# EAGLE design LoRasPI (EAGLE 7.6.0)
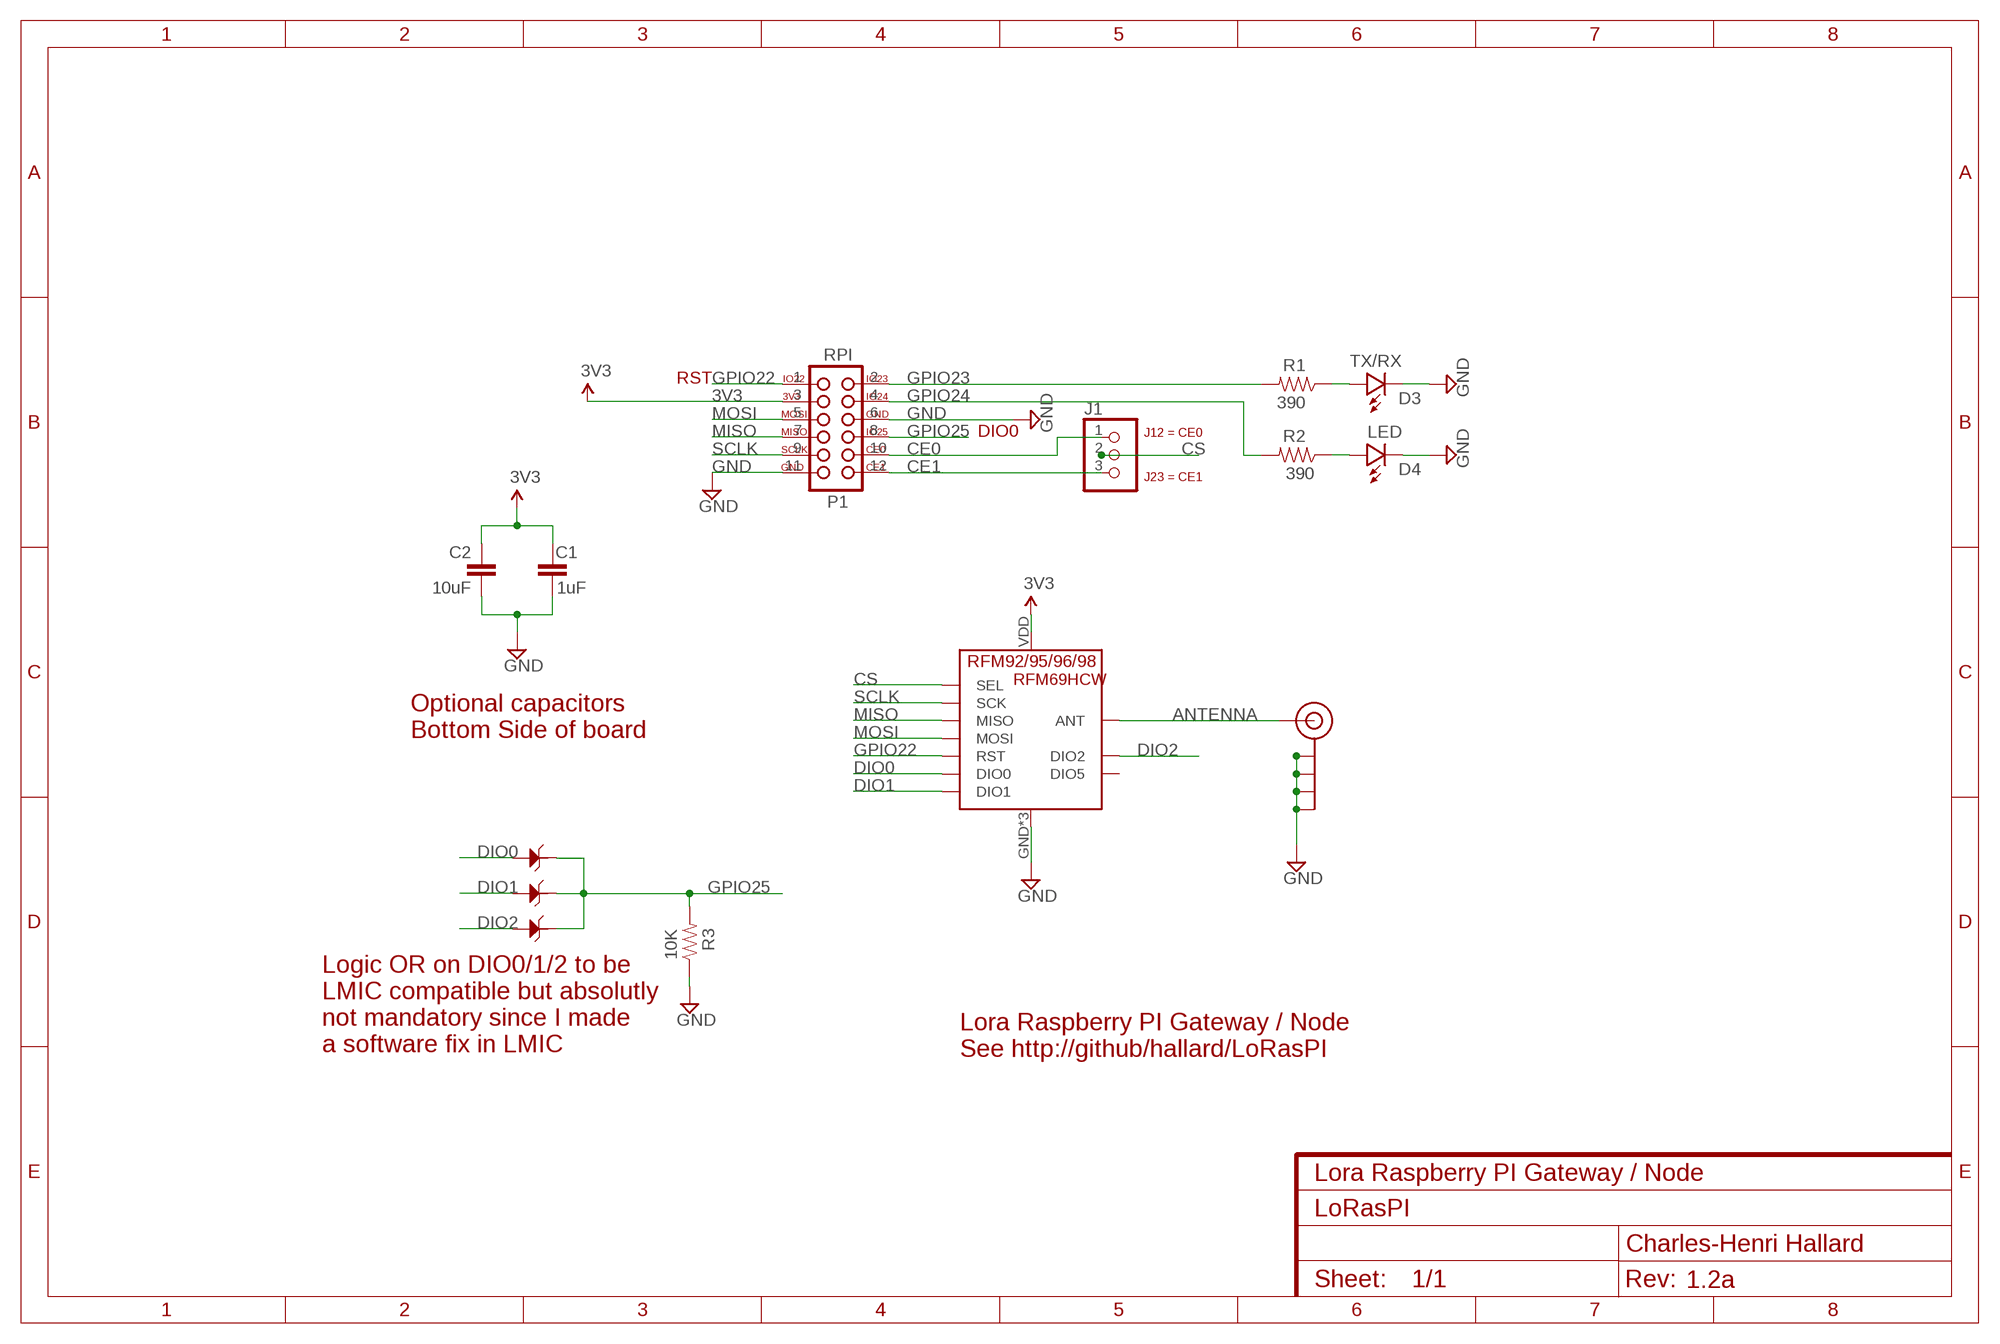
[diagram p0: schematic, sheet 1]
NAME (FRAME-A4L): CNAME: Lora Raspberry PI Gateway / Node; CREVISION: 1.2a; DESIGNER: Charles-Henri Hallard

## Parts
C1  1uF  CAP0805-CAP-LARGEPADS  [0805-CAP-LARGEPADS]
C2  10uF  CAP0805-CAP-LARGEPADS  [0805-CAP-LARGEPADS]
D0  1N4148  D-ESD-2P-CESD5V0D1  [SOD123-2.7X1.6]
D1  1N4148  D-ESD-2P-CESD5V0D1  [SOD123-2.7X1.6]
D2  1N4148  D-ESD-2P-CESD5V0D1  [SOD123-2.7X1.6]
D3  TX/RX  LED0805-LARGE  [0805-LED-LARGEPADS]
D4  LED  LED0805-LARGE  [0805-LED-LARGEPADS]
HOPE-RF  RFM92/95/96/98  RFM95  [RFM95]
J1  JUMPER_1X30805  [JP3_0805]
J$1  ANTENNATINY  [SMA_UFL_PAD_TINY]
R1  390  RESISTOR0805-RES  [0805-RES]
R2  390  RESISTOR0805-RES  [0805-RES]
R3  10K  RESISTOR0805-RES  [0805-RES]
U$2  RASPBERRY_PI_2X6_BOTTOM  [2X06_LOCK]

## Nets
3V3: C1.2 C2.2 HOPE-RF.VDD(VCC) U$2.3
ANTENNA: HOPE-RF.ANT J$1.ANT1(SIGNAL) J$1.ANT2(SIGNAL) J$1.ANT3(SIGNAL)
CE0: J1.1 U$2.10
CE1: J1.3 U$2.12
CS: HOPE-RF.NSS(SEL) J1.2
DIO0: D0.1 HOPE-RF.DIO0
DIO1: D1.1 HOPE-RF.DIO1
DIO2: D2.1 HOPE-RF.DIO2
GND: C1.1 C2.1 D3.MINUS D4.MINUS HOPE-RF.GND HOPE-RF.GND1(GND) HOPE-RF.GND2(GND) J$1.GND1(GND) J$1.GND2(GND) J$1.GND3(GND) J$1.GND4(GND) R3.1 U$2.6 U$2.11
GPIO22: HOPE-RF.RST U$2.1
GPIO23: R1.2 U$2.2
GPIO24: R2.2 U$2.4
GPIO25: D0.2 D1.2 D2.2 R3.2 U$2.8
MISO: HOPE-RF.MISO U$2.7
MOSI: HOPE-RF.MOSI U$2.5
N$1: D3.PLUS R1.1
N$2: D4.PLUS R2.1
SCLK: HOPE-RF.SCK U$2.9
Unconnected: HOPE-RF.DIO5

## Notes on the sheet
- RST
- DIO0
- CS
- CS | RFM69HCW
- Optional capacitors
  Bottom Side of board
- Lora Raspberry PI Gateway / Node
- Logic OR on DIO0/1/2 to be
  LMIC compatible but absolutly
  not mandatory since I made
  a software fix in LMIC
- See http://github/hallard/LoRasPI

## Library data of the parts
C1 C2 = _c2h:CAP: Capacitor Standard 0603 ceramic capacitor, and 0.1" leaded capacitor.
D0 D1 D2 = Seeed-Discrete:D-ESD-2P: Diodes for Protectiong against ESD
D3 D4 = _c2h:LED
HOPE-RF = _c2h:RFM95
J1 = dp_devices:JUMPER_1X3; J12: CE0; J23: CE1
J$1 = _c2h:ANTENNA: SMA Antenna Connector End launch SMA connector. The paste layer has been removed so that the connector can be hand soldered onto the board after reflow.
R1-R3 = _c2h:RESISTOR: Resistor Basic schematic elements and footprints for 0603, 1206, and PTH resistors.
U$2 = _c2h:RASPBERRY_PI_2X6_BOTTOM

## Board
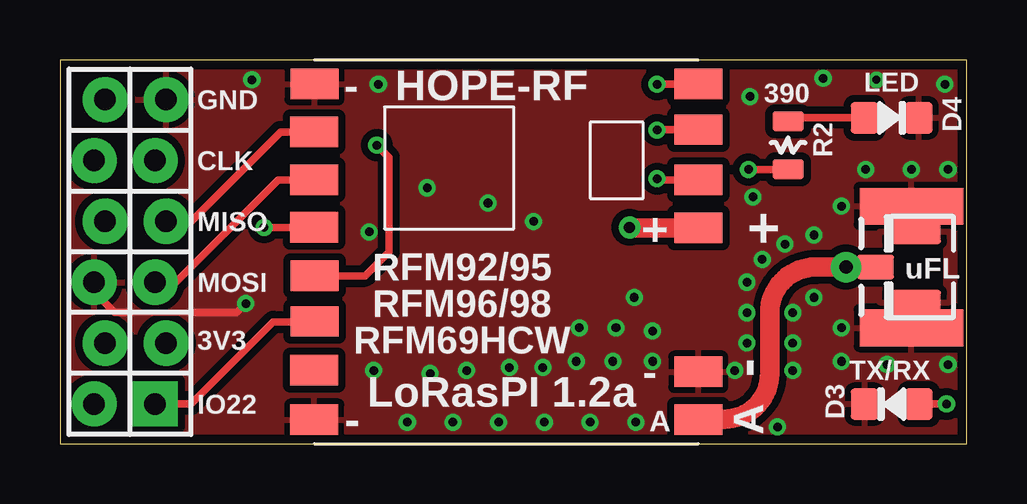
[diagram p1: board, top side]
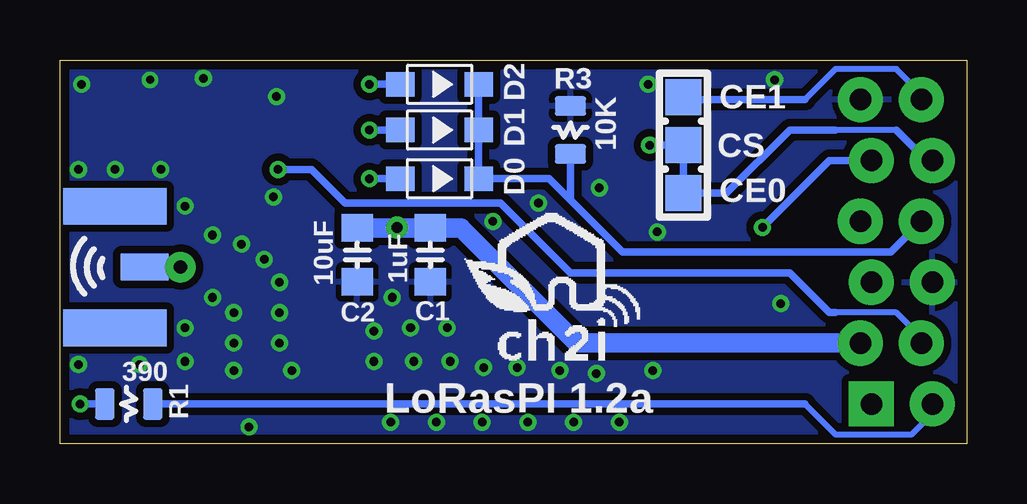
[diagram p2: board, bottom side, seen from below]

Size 37.79 x 16 mm. Coordinates in mm from the lower left corner, seen from the top.
Outline: 0,0 37.79,0 37.79,16 0,16 0,0
Copper layers (1*16): Top 0.0356mm / dielectric 1.5011mm / Bottom 0.0356mm
Design rules "PCBs_io": minimum track width 6mil, minimum drill 13mil, track to track 6mil, track to pad 6mil, pad to pad 6mil, via to via 6mil, smd to smd 6mil, copper to edge 15mil, drill to drill 6mil, minimum pad ring 7mil, minimum via ring 7mil, stop-mask expansion 3mil, vias tented up to drill 40mil, thermal gap 10mil

### Footprints (pad centres in the part's own frame; a part is rotated, then mirrored left to right if it is on the bottom)
0805-CAP-LARGEPADS = smd 1.156 x 1.3: 1 -1.127,0; 2 1.127,0
SOD123-2.7X1.6 = smd 1.2 x 1.02: 1 -1.635,0; 2 1.635,0
0805-LED-LARGEPADS = smd 1.156 x 1.3: MINUS -1.127,0; PLUS 1.127,0
RFM95 = smd 2 x 1.27: ANT 5.777,-7; DIO0 5.777,3; DIO1 5.779,5.095; DIO2 5.779,7; DIO5 -10.225,-4.936; GND 5.777,-5; GND1 -10.223,7; GND2 -10.23,-7; MISO -10.23,5; MOSI -10.225,3; NSS -10.223,-1; RST -10.223,-2.905; SCK -10.23,1.012; VDD 5.777,1
JP3_0805 = smd 1.5 x 1.5: 1 -2,0; 2 0,0; 3 2,0
SMA_UFL_PAD_TINY = smd 1.524 x 1.016: ANT1 -3.843,0 | drill 0.559 pad 1.27: ANT2 -5.08,0 | smd 2.032 x 1.143 bottom: ANT3 -3.589,0 | smd 2.2 x 1.016: GND1 -2.223,1.47; GND2 -2.223,-1.47 | smd 4.318 x 1.524: GND3 -2.349,-2.54; GND4 -2.349,2.54 | smd 4.318 x 1.524 bottom: GND5 -2.349,2.54; GND6 -2.349,-2.54
0805-RES = smd 0.8 x 1.3: 1 -1,0; 2 1,0
2X06_LOCK = drill 0.9 pad 1.88 square: 1 -6.35,-1.041 | drill 0.9 pad 1.88: 2 -6.35,1.499; 3 -3.81,-1.499; 4 -3.81,1.041; 5 -1.27,-1.041; 6 -1.27,1.499; 7 1.27,-1.499; 8 1.27,1.041; 9 3.81,-1.041; 10 3.81,1.499; 11 6.35,-1.499; 12 6.35,1.041

### Placement (x,y rotation side)
C1  22.35,7.87 90 bottom
C2  25.4,7.87 90 bottom
D0  21.97,11.05 0 bottom
D1  21.97,13.08 0 bottom
D2  21.97,14.99 0 bottom
D3  34.67,1.65 0 top
D4  34.67,13.59 180 top
HOPE-RF  20.83,8 0 top
J1  11.81,12.45 90 bottom
J$1  37.85,7.37 0 top
R1  34.93,1.65 0 bottom
R2  30.35,12.45 270 top
R3  16.51,13.08 270 bottom
U$2  2.92,8 90 top
U$4  [LOGO_CH2I_75MM]  16.83,5.46 0 bottom

### Tracks (layer width: path | path; a pad name or v marks a point on that pad's centre or on a via)
3V3  (via drill 0.46 pad 0.91)
  Top 0.813: 26.61,9.03 HOPE-RF.VDD 23.77,9 v23.75,9.02
  Bottom 0.813: U$2.3 16.26,4.19 21.07,9 C1.2 23.73,9 v23.75,9.02 23.77,9 C2.2
ANTENNA
  Top 0.813: J$1.ANT1 J$1.ANT2 31.5,7.37 arc90 29.59,5.46 29.59,2.92 arc-90 27.69,1.02 26.62,1.02 HOPE-RF.ANT
  Bottom 0.813: J$1.ANT3 J$1.ANT2
CE0
  Bottom 0.254: 2.92,13.08 5.46,13.08
  Bottom 0.305: U$2.10 1.65,11.81 2.92,13.08 | 5.46,13.08 7.37,13.08 10,10.45 J1.1 11.81,12.45
CE1
  Bottom 0.254: 1.88,14.58 2.92,15.62 5.46,15.62 6.73,14.35
  Bottom 0.305: U$2.12 1.88,14.58 | 6.73,14.35 11.72,14.35 J1.3
CS  (via drill 0.36 pad 0.71)
  Top 0.305: v13.21,12.45 13.72,11.94 13.72,8 12.72,7 HOPE-RF.NSS
  Bottom 0.305: v13.21,12.45 J1.2
DIO0  (via drill 0.36 pad 0.71)
  Top 0.305: HOPE-RF.DIO0 25.07,11 v24.89,11.05
  Bottom 0.305: v24.89,11.05 D0.1
DIO1  (via drill 0.36 pad 0.71)
  Top 0.305: HOPE-RF.DIO1 25.03,13.1 v24.89,13.08
  Bottom 0.305: v24.89,13.08 D1.1
DIO2  (via drill 0.36 pad 0.71)
  Top 0.305: HOPE-RF.DIO2 25.16,15 v24.89,14.99
  Bottom 0.305: v24.89,14.99 D2.1
GND  (via drill 0.33 pad 0.66, 0.36 pad 0.71)
  Top 0.254: 2.92,5.46 5.46,5.46
  Top 0.305: U$2.6 1.42,6.32 2.29,5.46 2.92,5.46 | 5.46,5.46 7.37,5.46 v7.75,5.84
  other vias: 13.08,3.05 8,15.18 12.89,8.83 22.1,0.89 15.43,2.92 19.75,9.27 34.04,15.18 28.64,6.73 28.64,5.46 28.64,4.19 29.27,7.68 30.23,8.32 30.54,3.05 30.54,4.19 30.54,5.46 29.91,0.7 31.43,8.7 31.43,6.1 24.7,3.43 24.7,4.7 23.18,4.83 21.65,4.83 24,0.89 28.13,3.05 35.5,11.43 34.48,3.3 32.58,4.83 32.58,9.91 20.19,0.89 18.29,0.89 16.38,0.89 14.48,0.89 28.77,14.48 21.53,3.43 33.59,11.43 37.02,11.43 32.58,3.43 37.02,3.3 28.89,10.29 23.05,3.43 18.73,3.17 36.89,14.99 15.3,10.67 13.27,14.99 31.81,15.24 23.94,6.1 17.84,10.03 20.13,3.17 16.95,3.05
  pour Bottom (isolate 0.305): -2.16,18.16 39.12,18.16 39.12,-2.16 -2.16,-2.16
  pour Top (isolate 0.305): -0.89,16.89 38.48,16.89 38.48,-0.89 -0.89,-0.89
GPIO22
  Top 0.305: HOPE-RF.RST 10.59,5.08 8.89,5.08 5.46,1.65 U$2.1
GPIO23
  Bottom 0.254: 6.73,1.65 5.46,0.38 2.29,0.38 1.42,1.24
  Bottom 0.305: R1.2 6.73,1.65 | U$2.2 1.42,1.24
GPIO24  (via drill 0.36 pad 0.71)
  Top 0.305: v28.7,11.43 29.99,11.43 R2.2
  Bottom 0.254: U$2.4 1.88,4.42 2.92,5.46 5.46,5.46
  Bottom 0.305: 5.46,5.46 5.71,5.46 7.37,7.11 16.51,7.11 19.43,10.03 25.91,10.03 27.3,11.43 v28.7,11.43
GPIO25
  Bottom 0.305: D2.2 D1.2 D0.2 17.4,11.05 16.57,10.22 | U$2.8 3.15,8 14.35,8 16.57,10.22 | R3.2 16.51,10.29 16.57,10.22
MISO
  Top 0.305: U$2.7 5.46,9.27 9.19,13 HOPE-RF.MISO
MOSI
  Top 0.305: U$2.5 4.83,6.73 9.1,11 HOPE-RF.MOSI
N$1  (via drill 0.36 pad 0.71)
  Top 0.305: D3.PLUS v36.96,1.65
  Bottom 0.305: v36.96,1.65 R1.1
N$2
  Top 0.305: D4.PLUS 30.5,13.59 R2.1
SCLK  (via drill 0.36 pad 0.71)
  Top 0.305: v8.51,9.02 HOPE-RF.SCK
  Bottom 0.305: U$2.9 5.71,11.81 v8.51,9.02

### Text on the board
tPlace: GND | CLK | MISO | + | RFM92/95 | MOSI | RFM96/98 | 3V3 | RFM69HCW | - | LoRasPI 1.2a | IO22 | A
bPlace: CS | LoRasPI 1.2a